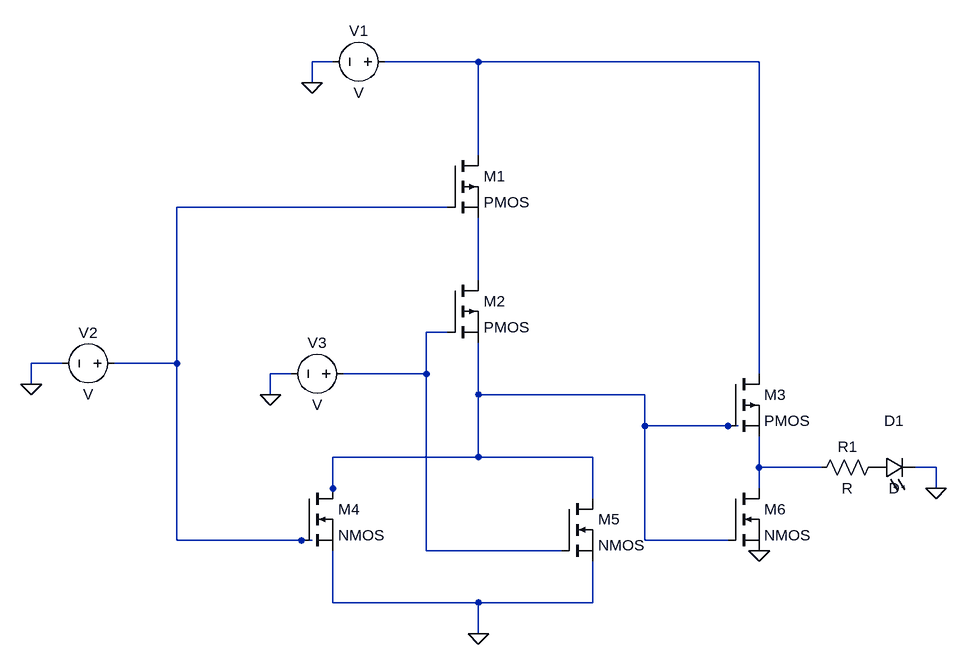
[diagram p0: schematic CMOS_OR_Gate.asc]
CMOS_OR_Gate.asc, the LTspice schematic file:
Version 4
SHEET 1 916 820
WIRE -32 -80 -64 -80
WIRE 192 -80 48 -80
WIRE 624 -80 192 -80
WIRE -64 -48 -64 -80
WIRE 192 64 192 -80
WIRE 144 144 -272 144
WIRE 192 256 192 160
WIRE 144 336 112 336
WIRE -448 384 -496 384
WIRE -272 384 -272 144
WIRE -272 384 -368 384
WIRE -96 400 -128 400
WIRE 112 400 112 336
WIRE 112 400 -16 400
WIRE 624 400 624 -80
WIRE -496 416 -496 384
WIRE -128 432 -128 400
WIRE 192 432 192 352
WIRE 448 432 192 432
WIRE 448 480 448 432
WIRE 576 480 448 480
WIRE 592 480 576 480
WIRE 192 528 192 432
WIRE 192 528 -32 528
WIRE 368 528 192 528
WIRE 624 544 624 496
WIRE 720 544 624 544
WIRE 896 544 864 544
WIRE -32 576 -32 528
WIRE 624 576 624 544
WIRE 896 576 896 544
WIRE -32 592 -32 576
WIRE 368 592 368 528
WIRE -272 656 -272 384
WIRE -80 656 -272 656
WIRE -64 656 -80 656
WIRE 448 656 448 480
WIRE 576 656 448 656
WIRE 112 672 112 400
WIRE 320 672 112 672
WIRE -32 752 -32 672
WIRE 192 752 -32 752
WIRE 368 752 368 688
WIRE 368 752 192 752
WIRE 192 800 192 752
FLAG -64 -48 0
FLAG 192 800 0
FLAG 624 672 0
FLAG 896 576 0
FLAG -496 416 0
FLAG -128 432 0
SYMBOL pmos 144 64 R0
SYMATTR InstName M1
SYMBOL pmos 144 256 R0
SYMATTR InstName M2
SYMBOL pmos 576 400 R0
SYMATTR InstName M3
SYMBOL nmos -80 576 R0
SYMATTR InstName M4
SYMBOL nmos 320 592 R0
SYMATTR InstName M5
SYMBOL nmos 576 576 R0
SYMATTR InstName M6
SYMBOL voltage 64 -80 R90
WINDOW 0 -32 56 VBottom 2
WINDOW 3 32 56 VTop 2
SYMATTR InstName V1
SYMBOL res 816 528 R90
WINDOW 0 0 56 VBottom 2
WINDOW 3 32 56 VTop 2
SYMATTR InstName R1
SYMBOL LED 800 560 R270
WINDOW 0 72 32 VTop 2
WINDOW 3 0 32 VBottom 2
SYMATTR InstName D1
SYMBOL voltage -352 384 R90
WINDOW 0 -32 56 VBottom 2
WINDOW 3 32 56 VTop 2
SYMATTR InstName V2
SYMBOL voltage 0 400 R90
WINDOW 0 -32 56 VBottom 2
WINDOW 3 32 56 VTop 2
SYMATTR InstName V3

The netlist it stands for:
* CMOS_OR_Gate.asc
M1 N001 N002 N003 N003 PMOS
M2 N003 N004 N005 N005 PMOS
M3 N001 N005 N006 N006 PMOS
M4 N005 N002 0 0 NMOS
M5 N005 N004 0 0 NMOS
M6 N006 N005 0 0 NMOS
V1 N001 0 V
R1 P001 N006 R
D1 P001 0 D
V2 N002 0 V
V3 N004 0 V
.model D D
.lib standard.dio
.model NMOS NMOS
.model PMOS PMOS
.lib standard.mos
.backanno
.end